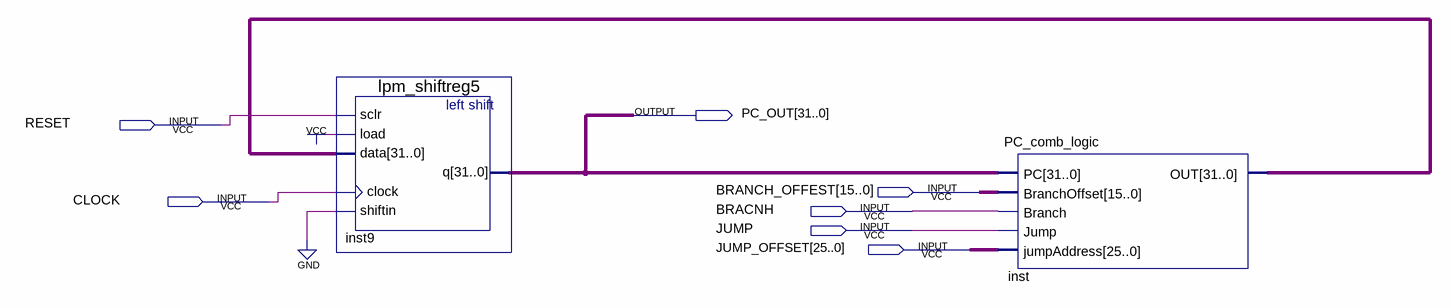
[diagram p0: schematic sheet]
// Quartus schematic NEW_PC.bdf as structural Verilog: 2 symbols, 7 pins
module NEW_PC (
  input  RESET,
  input  [15:0] BRANCH_OFFEST,
  input  CLOCK,
  input  BRACNH,
  input  JUMP,
  input  [25:0] JUMP_OFFSET,
  output [31:0] PC_OUT
);

  wire [31:0] inst_out;

  lpm_shiftreg5 inst9 (.sclr(RESET), .load(1'b1), .data(inst_out), .clock(CLOCK), .shiftin(1'b0), .q(PC_OUT));
  PC_comb_logic inst (
    .PC(PC_OUT), .BranchOffset(BRANCH_OFFEST), .Branch(BRACNH), .Jump(JUMP), .jumpAddress(JUMP_OFFSET),
    .OUT(inst_out));
endmodule
